# Altium schematic sheet IrPwr.SchDoc: IrDA - Power
size A4; Organization: Microprocessor-Design Pty Ltd; Address1: 18/110 Caroline Street; Address2: South Yarra; Address3: VIC 3141; Address4: Australia; DocumentNumber: 2; SheetNumber: 2; SheetTotal: 4
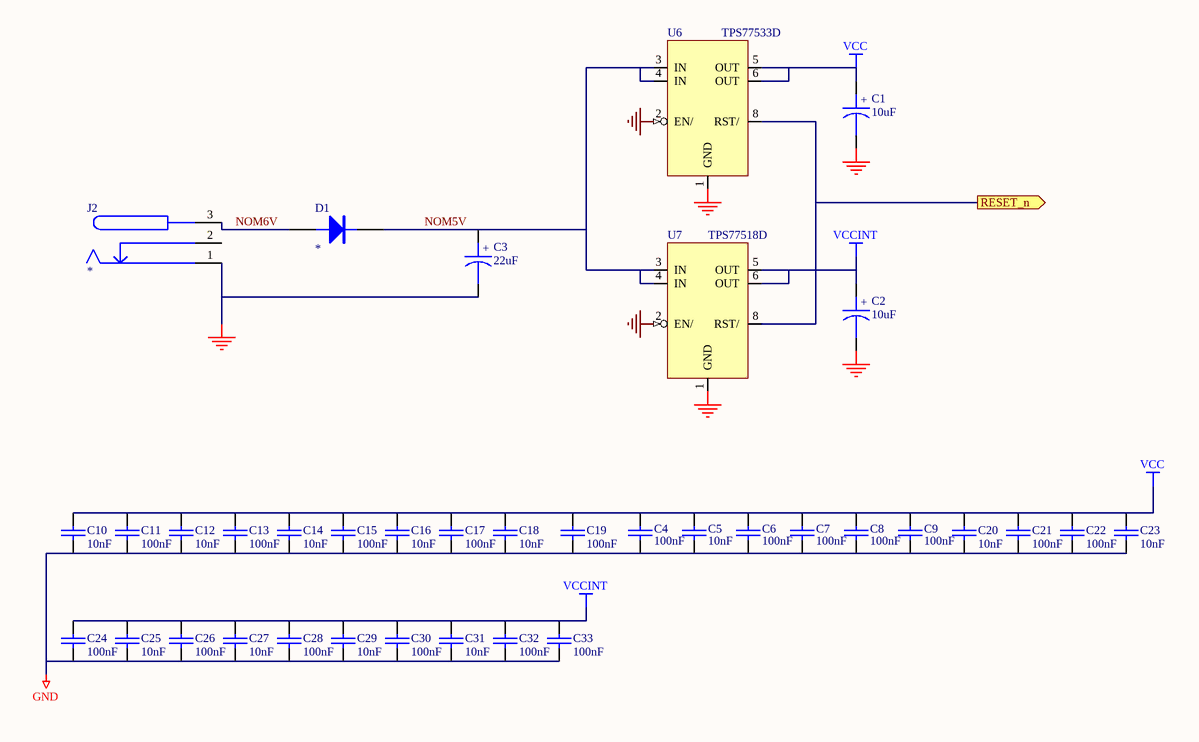
[diagram p0: IrPwr.SchDoc]

## Parts
C1  10uF  [3216POL]
C2  10uF  [3216POL]
C3  22uF  [3216POL]
C4  100nF  [M0603]
C5  10nF  [M0603]
C6  100nF  [M0603]
C7  100nF  [M0603]
C8  100nF  [M0603]
C9  100nF  [M0603]
C10  10nF  [M0603]
C11  100nF  [M0603]
C12  10nF  [M0603]
C13  100nF  [M0603]
C14  10nF  [M0603]
C15  100nF  [M0603]
C16  10nF  [M0603]
C17  100nF  [M0603]
C18  10nF  [M0603]
C19  100nF  [M0603]
C20  10nF  [M0603]
C21  100nF  [M0603]
C22  100nF  [M0603]
C23  10nF  [M0603]
C24  100nF  [M0603]
C25  10nF  [M0603]
C26  100nF  [M0603]
C27  10nF  [M0603]
C28  100nF  [M0603]
C29  10nF  [M0603]
C30  100nF  [M0603]
C31  10nF  [M0603]
C32  100nF  [M0603]
C33  100nF  [M0603]
D1  *  [SOT23]
J2  *  [DC-SOCKET]
U6  TPS77533D  [SO8]
U7  TPS77518D  [SO8]

## Ports
RESET_n (out)

## Nets
GND: C1.2 C2.2 C3.2 C4.2 C5.2 C6.2 C7.2 C8.2 C9.2 C10.2 C11.2 C12.2 C13.2 C14.2 C15.2 C16.2 C17.2 C18.2 C19.2 C20.2 C21.2 C22.2 C23.2 C24.2 C25.2 C26.2 C27.2 C28.2 C29.2 C30.2 C31.2 C32.2 C33.2 J2.1(SHELL) U6.1(GND) U6.2(EN/) U7.1(GND) U7.2(EN/)
VCC: C1.1 C4.1 C5.1 C6.1 C7.1 C8.1 C9.1 C10.1 C11.1 C12.1 C13.1 C14.1 C15.1 C16.1 C17.1 C18.1 C19.1 C20.1 C21.1 C22.1 C23.1 U6.5(OUT) U6.6(OUT)
VCCINT: C2.1 C24.1 C25.1 C26.1 C27.1 C28.1 C29.1 C30.1 C31.1 C32.1 C33.1 U7.5(OUT) U7.6(OUT)
NOM5V: C3.1 D1.2(K) U6.3(IN) U6.4(IN) U7.3(IN) U7.4(IN)
NOM6V: D1.1(A) J2.3(CENTRE)
RESET_n: U6.8(RST/) U7.8(RST/) ; port RESET_n

Not connected (* = marked no-connect by the designer): J2 2(CNTCT)

## Notes on the sheet
- Title
- Size:
- Date:
- A4
- Number:
- Time:
- Revision:
- Sheet
- of
- File:
- (in symbol CAPACITOR-POL) +

## Library data of the parts
C1-C3 = CAPACITOR-POL: ELECTROLYTIC/TANTALUM CAP
C4-C33 = CAP: Cap 0603; Text Field1: A TEXT FIELD
D1 = DIODE
J2 = DC-SOCKET: Switchcraft RASM712,Kycon KLD-SMT-0201
U6 U7 = TPS77518D: LDO 1V8 500mA